# EAGLE design Nano RC Receiver (EAGLE 9.6.1)
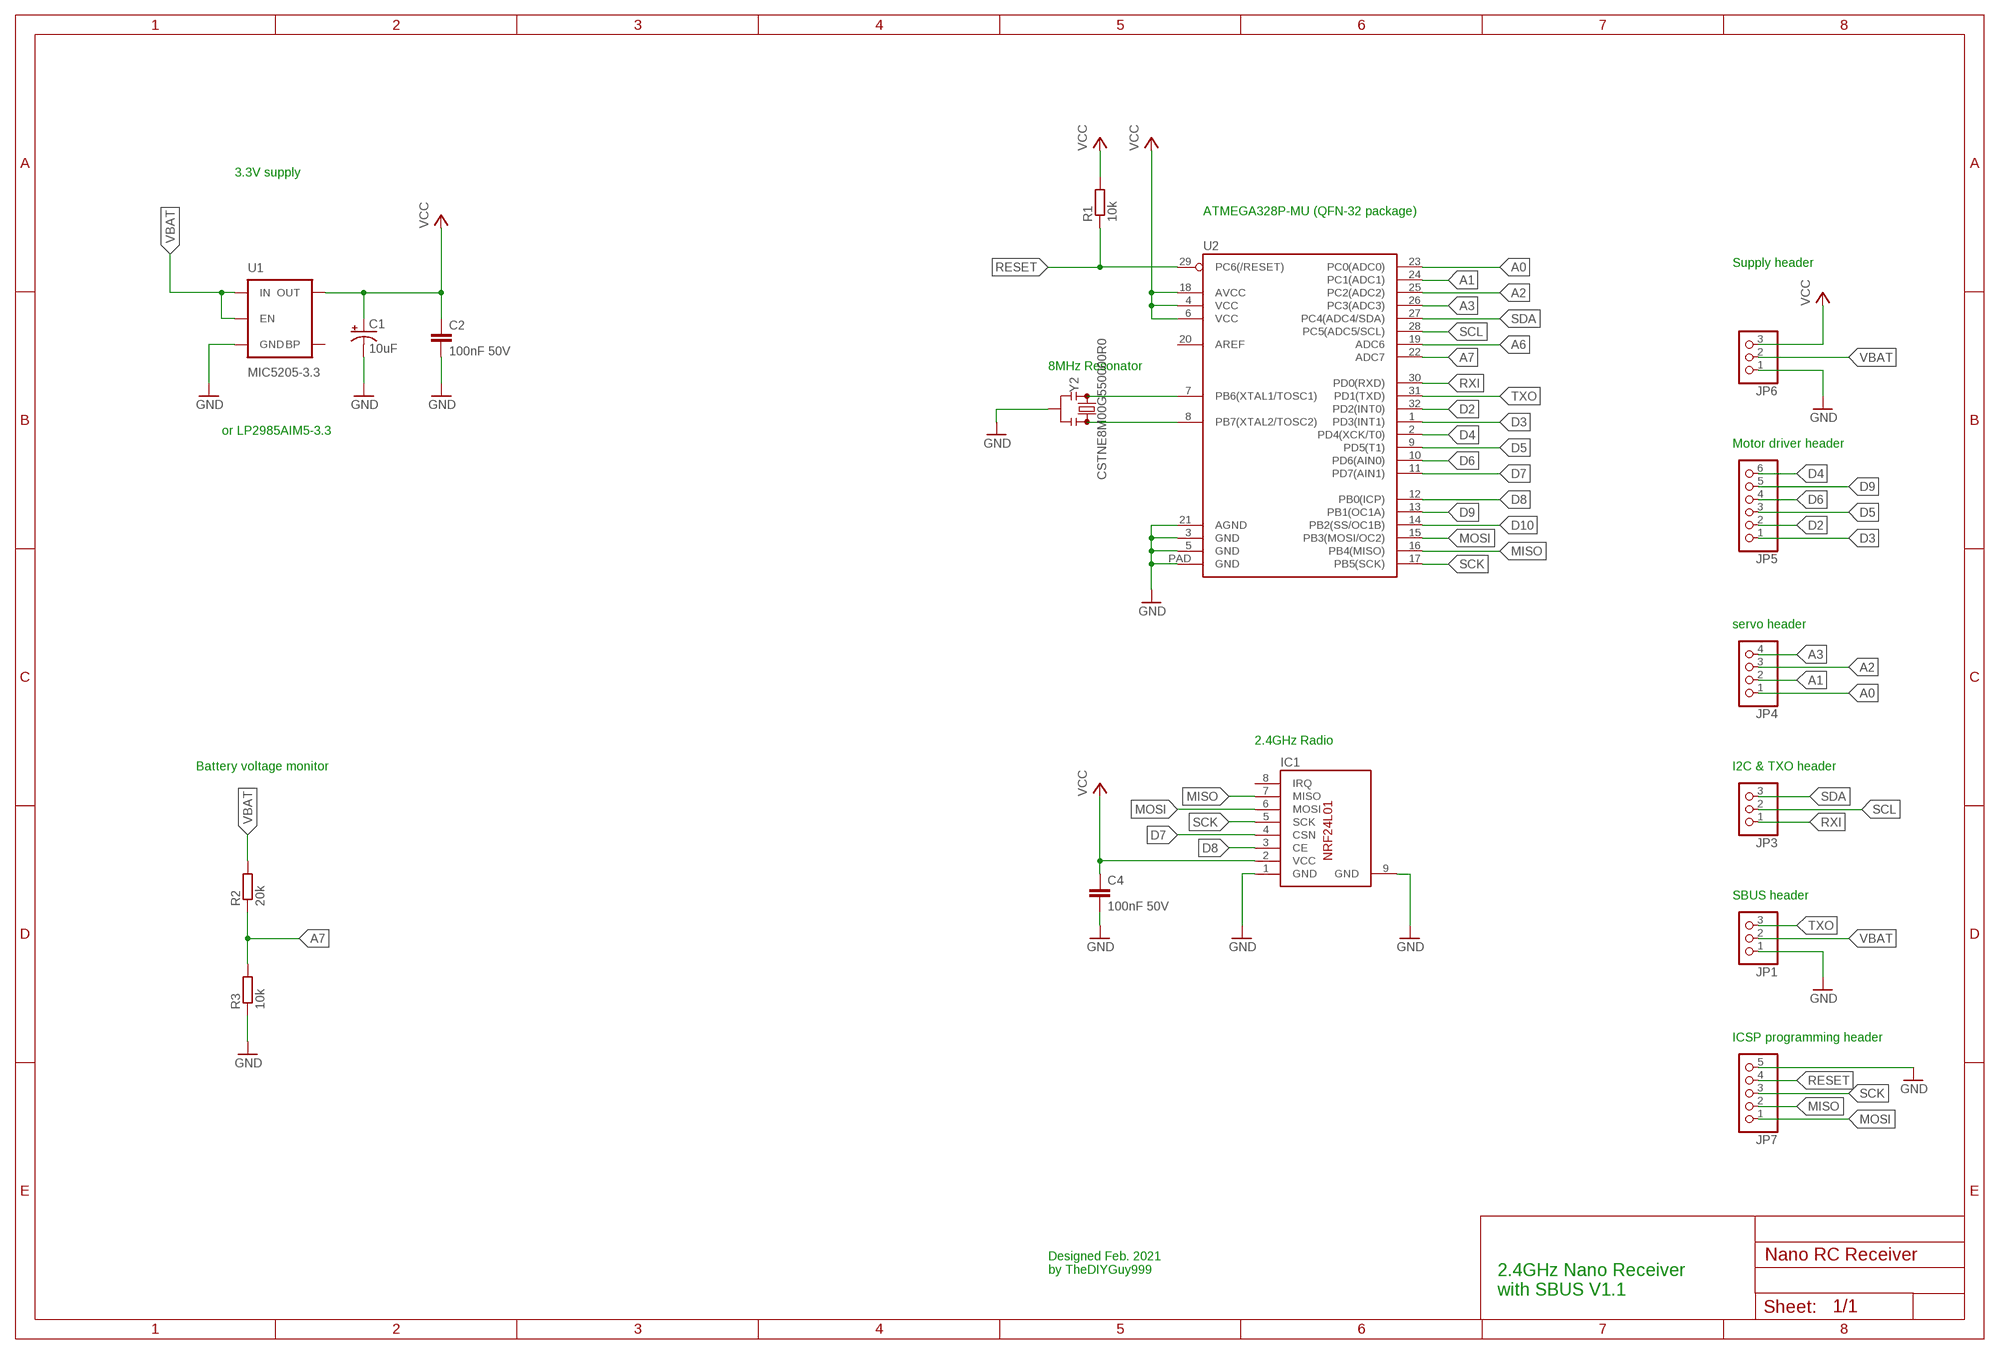
[diagram p0: schematic, sheet 1]

## Parts
C1  10uF  10UF-16V-10%(TANT)  [EIA3216]
C2  100nF 50V  C-EUC0603  [C0603]
C4  100nF 50V  C-EUC0603  [C0603]
IC1  NRF24L01SMD_PAD  [NRF24L01_SMD_PAD]
JP1  PINHD-1X3SMT  [1X03_SMT]
JP3  PINHD-1X31.27  [1X03_1.27]
JP4  PINHD-1X41.27  [1X04_1.27]
JP5  PINHD-1X61.27  [1X06_1.27]
JP6  PINHD-1X31.27  [1X03_1.27]
JP7  PINHD-1X51.27  [1X05_1.27]
R1  10k  R-EU_R0603  [R0603]
R2  20k  R-EU_R0603  [R0603]
R3  10k  R-EU_R0603  [R0603]
U1  MIC5205-3.3  MIC52053.3V  [SOT23-5]
U2  ATMEGA328P_MLFMLF32  [MLF32-PAD]
Y2  CSTNE8M00G550000R0  RESONATORSMD-3.2X1.3  [RESONATOR-SMD-3.2X1.3]

## Nets
A0: JP4.1 U2.23(PC0(ADC0))
A1: JP4.2 U2.24(PC1(ADC1))
A2: JP4.3 U2.25(PC2(ADC2))
A3: JP4.4 U2.26(PC3(ADC3))
A6: U2.19(ADC6)
A7: R2.1 R3.2 U2.22(ADC7)
D2: JP5.2 U2.32(PD2(INT0))
D3: JP5.1 U2.1(PD3(INT1))
D4: JP5.6 U2.2(PD4(XCK/T0))
D5: JP5.3 U2.9(PD5(T1))
D6: JP5.4 U2.10(PD6(AIN0))
D7: IC1.4(CSN) U2.11(PD7(AIN1))
D8: IC1.3(CE) U2.12(PB0(ICP))
D9: JP5.5 U2.13(PB1(OC1A))
D10: U2.14(PB2(SS/OC1B))
GND: C1.C(-) C2.2 C4.2 IC1.1(GND) IC1.9(GND) JP1.1 JP6.1 JP7.5 R3.1 U1.2(GND) U2.3(GND) U2.5(GND) U2.21(AGND) U2.PAD(GND) Y2.2
MISO: IC1.7(MISO) JP7.2 U2.16(PB4(MISO))
MOSI: IC1.6(MOSI) JP7.1 U2.15(PB3(MOSI/OC2))
RESET: JP7.4 R1.1 U2.29(PC6(/RESET))
RXI: JP3.1 U2.30(PD0(RXD))
SCK: IC1.5(SCK) JP7.3 U2.17(PB5(SCK))
SCL: JP3.2 U2.28(PC5(ADC5/SCL))
SDA: JP3.3 U2.27(PC4(ADC4/SDA))
TOSC1: U2.7(PB6(XTAL1/TOSC1)) Y2.1
TOSC2: U2.8(PB7(XTAL2/TOSC2)) Y2.3
TXO: JP1.3 U2.31(PD1(TXD))
VBAT: JP1.2 JP6.2 R2.2 U1.1(IN) U1.3(EN)
VCC: C1.A(+) C2.1 C4.1 IC1.2(VCC) JP6.3 R1.2 U1.5(OUT) U2.4(VCC) U2.6(VCC) U2.18(AVCC)
Unconnected: IC1.8(IRQ) U1.4(BP) U2.20(AREF)

## Notes on the sheet
- 3.3V supply
- ATMEGA328P-MU (QFN-32 package)
- Supply header
- 8MHz Resonator
- or LP2985AIM5-3.3
- Motor driver header
- servo header
- 2.4GHz Radio
- Battery voltage monitor | I2C & TXO header
- SBUS header
- ICSP programming header
- Designed Feb. 2021
  by TheDIYGuy999
- 2.4GHz Nano Receiver
  with SBUS V1.1

## Library data of the parts
C1 = SparkFun-Capacitors:10UF-16V-10%(TANT): CAP-00811 1206/EIA-3216 Tantalum capacitor; PROD_ID: CAP-00811
C2 C4 = rcl:C-EU: CAPACITOR, European symbol; SPICEPREFIX: C
IC1 = 00_custom:NRF24L01: 2.4GHz Radio Module
JP1 JP3 JP6 = 00_custom_pinhead:PINHD-1X3: PIN HEADER
JP4 = 00_custom_pinhead:PINHD-1X4: PIN HEADER
JP5 = 00_custom_pinhead:PINHD-1X6: PIN HEADER
JP7 = 00_custom_pinhead:PINHD-1X5: PIN HEADER
R1-R3 = rcl:R-EU_: RESISTOR, European symbol; SPICEPREFIX: R
U1 = SparkFun-PowerIC:MIC5205: MIC5205 150mA vreg 3.3V - VREG-00822 5V - VREG-00823; PROD_ID: VREG-00822
U2 = SparkFun-IC-Microcontroller:ATMEGA328P_MLF: Datasheet SparkFun Products () () 32-Pin Atmega328 part Commonly used on Arduino compatible boards Available in QFP and QFN packages TQFP is IC-09069 QFN is non-stock
Y2 = SparkFun-Clocks:RESONATOR: Resonators (Generic) Ceramic resonators are clock-generating components, often used to control timing in microcontrollers. They usually have 3 pins: two pins for oscillation, and one pin for ground. Compared to crystals, resonators have worse tolerance, but are usually much cheaper. Plus, they have built-in load capacitors! These devices are used on boards like the Arduino Pro 8MHz <https://www.sparkfun.com/products/11114> and Arduino Pro 16MHz <https://www.sparkfun.com/products/11113>.

## Board
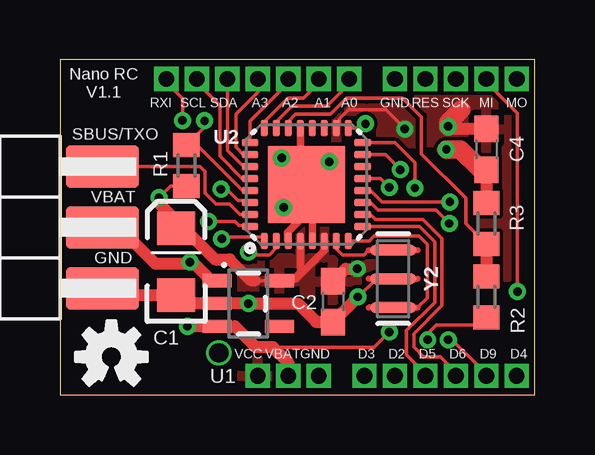
[diagram p1: board, top side]
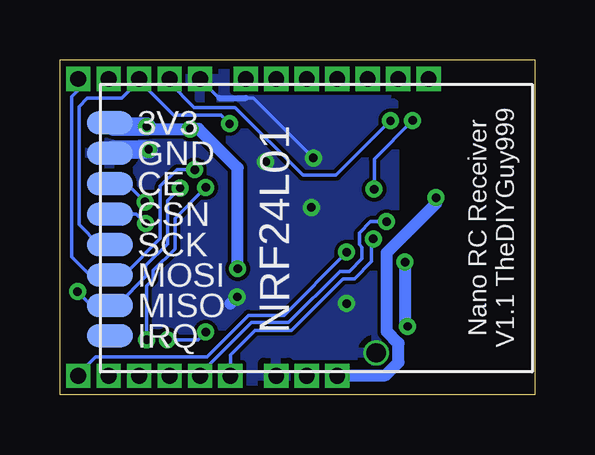
[diagram p2: board, bottom side, seen from below]

Size 19.81 x 13.97 mm. Coordinates in mm from the lower left corner, seen from the top.
Outline: 0,0 19.81,0 19.81,13.97 0,13.97 0,0
Copper layers (1*16): Top 0.0356mm / dielectric 1.5011mm / Bottom 0.0356mm
Design rules "OSHPark_LaenPCBOrder *": minimum track width 6mil, minimum drill 13mil, track to track 6mil, track to pad 6mil, pad to pad 6mil, via to via 6mil, smd to smd 6mil, copper to edge 15mil, drill to drill 6mil, minimum pad ring 5mil, minimum via ring 7mil, stop-mask expansion 1mil, vias tented up to drill 24mil, thermal gap 10mil

### Footprints (pad centres in the part's own frame; a part is rotated, then mirrored left to right if it is on the bottom)
EIA3216 = smd 1.4 x 1.6: A 1.4,0; C -1.4,0
C0603 = smd 1.1 x 1: 1 -0.85,0; 2 0.85,0
NRF24L01_SMD_PAD = smd 0.965 x 1.93: 1 1.27,-0.508; 2 0,-0.508; 3 2.54,-0.508; 4 3.81,-0.508; 5 5.08,-0.508; 6 6.35,-0.508; 7 7.62,-0.508; 8 8.89,-0.508 | drill 0.8 pad 1.016: 9 9.6,10.6
1X03_SMT = smd 1.778 x 3.048: 1 0,-1.143; 2 2.54,-1.143; 3 5.08,-1.143
1X03_1.27 = drill 0.65 pad 1.016 square: 1 0,0; 2 1.27,0; 3 2.54,0
1X04_1.27 = drill 0.65 pad 1.016 square: 1 0,0; 2 1.27,0; 3 2.54,0; 4 3.81,0
1X06_1.27 = drill 0.65 pad 1.016 square: 1 0,0; 2 1.27,0; 3 2.54,0; 4 3.81,0; 5 5.08,0; 6 6.35,0
1X05_1.27 = drill 0.65 pad 1.016 square: 1 0,0; 2 1.27,0; 3 2.54,0; 4 3.81,0; 5 5.08,0
R0603 = smd 1 x 1.1: 1 -0.85,0; 2 0.85,0
SOT23-5 = smd 0.55 x 1.2: 1 -0.95,-1.3; 2 0,-1.3; 3 0.95,-1.3; 4 0.95,1.3; 5 -0.95,1.3
MLF32-PAD = smd 0.7 x 0.3: 1 -2.35,1.75; 2 -2.35,1.25; 3 -2.35,0.75; 4 -2.35,0.25; 5 -2.35,-0.25; 6 -2.35,-0.75; 7 -2.35,-1.25; 8 -2.35,-1.75; 17 2.35,-1.75; 18 2.35,-1.25; 19 2.35,-0.75; 20 2.35,-0.25; 21 2.35,0.25; 22 2.35,0.75; 23 2.35,1.25; 24 2.35,1.75 | smd 0.3 x 0.7: 9 -1.75,-2.35; 10 -1.25,-2.35; 11 -0.75,-2.35; 12 -0.25,-2.35; 13 0.25,-2.35; 14 0.75,-2.35; 15 1.25,-2.35; 16 1.75,-2.35; 25 1.75,2.35; 26 1.25,2.35; 27 0.75,2.35; 28 0.25,2.35; 29 -0.25,2.35; 30 -0.75,2.35; 31 -1.25,2.35; 32 -1.75,2.35 | smd 3.2 x 3.2: PAD 0,0
RESONATOR-SMD-3.2X1.3 = smd 0.45 x 1.905: 1 -1.2,0; 2 0,0; 3 1.2,0

### Placement (x,y rotation side)
C1  4.84,5.56 90 top
C2  11.39,3.89 270 top
C4  17.78,10.24 270 top
IC1  17.22,11.35 270 bottom
JP1  0.64,4.45 90 top
JP3  4.45,13.18 0 top
JP4  12.06,13.18 180 top
JP5  12.7,0.79 0 top
JP6  10.79,0.79 180 top
JP7  19.05,13.18 180 top
LOGO2  OSHW-LOGOS  [OSHW-LOGO-S]  2.14,1.59 0 top
R1  5.28,9.56 270 top
R2  17.78,4.09 270 top
R3  17.78,7.14 270 top
U1  7.86,3.81 270 top
U2  10.28,8.77 90 top
Y2  13.89,4.84 270 top

### Tracks (layer width: path | path; a pad name or v marks a point on that pad's centre or on a via)
A0
  Top 0.152: U2.23 9.07,11.16 9.07,11.44 9.68,12.05 11.13,12.05 12.06,12.99 JP4.1
A1
  Top 0.152: U2.24 8.57,11.16 8.57,11.44 9.51,12.38 10.16,12.38 10.79,13.02 JP4.2
A2
  Top 0.152: JP4.3 9.53,13.02 7.93,11.42 U2.25
A3
  Top 0.152: U2.26 7.89,9.98 7.69,9.98 7.34,10.33 7.34,11.71 8.26,12.62 JP4.4
A7
  Top 0.152: R3.2 16.92,7.15 16.92,8.21 15.08,10.05 15.08,11.59 14.29,12.38 12.8,12.38 12.79,12.37 11.94,12.37 11.27,11.7 9.83,11.7 9.51,11.38 9.53,11.36 U2.22
  Top 0.508: R3.2 R2.1
D2  (via drill 0.35)
  Top 0.152: U2.32 7.89,7.06 7.46,7.06 7.3,7.22 v6.19,7.22
  Bottom 0.152: v6.19,7.22 6.86,7.22 7.33,6.75 7.33,6.27 7.21,6.15 7.21,5.68 7.74,5.15 8.14,5.15 10.27,3.02 11.83,3.02 13.97,0.87 JP5.2
D3  (via drill 0.35)
  Top 0.152: U2.1 8.53,6.59 6.83,6.59 v6.75,6.51
  Bottom 0.152: v6.75,6.51 6.83,6.43 6.83,5.56 7.54,4.84 8.01,4.84 10.15,2.7 11.67,2.7 12.7,1.67 JP5.1
D4  (via drill 0.35)
  Top 0.152: v7.86,5.95 7.97,5.84 8.73,5.84 8.99,6.1 8.99,6.38 U2.2
  Bottom 0.152: JP5.6 18.99,0.85 18.99,0.92 18.33,1.59 13.69,1.59 11.95,3.32 10.47,3.32 7.86,5.94 v7.86,5.95
D5
  Top 0.152: U2.9 15,7.02 15.63,6.39 15.63,3.86 14.45,2.68 14.45,1.67 15.24,0.87 JP5.3
D6
  Top 0.152: U2.10 12.95,7.52 13.15,7.32 15.12,7.32 15.93,6.51 15.93,3.74 14.75,2.55 14.75,2 15.16,1.59 15.87,1.59 16.51,0.94 JP5.4
D7  (via drill 0.35)
  Top 0.152: U2.11 12.95,8.02 13.26,7.7 15.68,7.7 v16.24,7.15
  Bottom 0.152: IC1.4 16.63,7.54 v16.24,7.15
D8  (via drill 0.35)
  Top 0.152: U2.12 12.95,8.52 13.42,8.04 15.55,8.04 15.55,8.05 v16.26,8.05
  Bottom 0.152: v16.26,8.05 17.03,8.81 IC1.3
D9  (via drill 0.35)
  Top 0.152: JP5.5 17.48,1.09 17.48,1.16 16.34,2.3 v16.19,2.3 | v13.73,8.65 13.36,9.02 U2.13
  Bottom 0.152: v16.19,2.3 16.19,4.54 15.93,4.8 15.93,5.18 15.02,6.09 15.02,7.37 v13.73,8.65
GND  (via drill 0.35)
  Top 0.152: Y2.2 13.83,4.78 13.13,4.78 v12.43,4.08 | v9.33,7.82 10.03,8.52 U2.21 10.03,10.27 9.64,9.88 v9.25,9.88
  Top 0.305: U2.21 10.03,9.02 U2.PAD | U2.5 10.53,7.28 10.84,7.58 10.84,8.21 U2.PAD | U2.PAD 10.28,7.56 9.49,6.77 9.49,6.46 U2.3
  Top 0.508: C4.2 R3.1 | v12.42,4.09 v12.43,4.08 C2.2 10.69,3.04 9.92,3.81 v7.86,3.81 U1.2 5.19,3.81 C1.C 2.19,4.16 JP1.1
  Top 0.762: C4.2 17.54,9.39 16.69,10.24 v16.11,10.24
  Bottom 0.152: JP7.5 13.18,12.38 | 12.06,12.38 11.75,12.38 v9.25,9.88
  Bottom 0.254: 13.18,12.38 12.06,12.38
  Bottom 0.508: v16.11,10.24 16.19,10.32 | v12.42,4.09 12.7,3.81
  Bottom 0.762: IC1.1 17.57,10.24 v16.11,10.24
  other vias: 11.23,9.72
  pour Bottom: 6.19,16.51 21.59,16.51 21.59,-2.54 5.87,-2.54 5.87,12.14 6.19,12.14
MISO  (via drill 0.35)
  Top 0.152: U2.16 13.97,10.52 14.8,9.68 v14.8,8.63 | v19.08,4.31 19.08,11.75 17.78,13.05 JP7.2
  Bottom 0.152: v19.08,4.31 v19.08,4.3 18.59,3.81 17.82,3.81 IC1.7 17.65,3.73 17.58,3.81 17.35,3.81 16.23,4.93 16.23,5.39 15.32,6.3 15.32,8.11 v14.8,8.63
MOSI  (via drill 0.35)
  Top 0.152: v14.19,9.39 13.56,10.02 U2.15
  Bottom 0.152: v14.19,9.39 14.94,9.39 15.63,8.7 15.63,6.52 17.14,5 IC1.6 18.57,5 19.32,5.75 19.32,12.44 19.06,12.71 JP7.1
RESET  (via drill 0.35)
  Top 0.152: U2.29 7.61,8.52 5.72,10.41 R1.1 6.03,11.17 v6.03,11.43
  Bottom 0.152: v6.03,11.43 8.29,9.17 9.68,9.17 12.5,11.99 14.21,11.99 15.24,13.02 JP7.4
RXI  (via drill 0.35)
  Top 0.152: U2.30 7.85,8.1 7.43,8.1 6.95,8.58 v6.71,8.58 | JP3.1 4.45,13.03 5.11,12.37 v5.11,11.44
  Bottom 0.152: v5.11,11.44 6.71,9.84 v6.71,8.58
SCK  (via drill 0.35)
  Top 0.152: v12.74,11.31 12.55,11.12 U2.17
  Bottom 0.152: v12.74,11.31 13.1,11.67 15.08,11.67 16.51,13.1 JP7.3 16.49,13.15 16.49,13.13 17.24,12.38 18.67,12.38 19.02,12.03 19.02,7.1 18.19,6.27 IC1.5
SCL
  Top 0.152: U2.28 7.72,9.02 7.71,9.02 7.59,9.02 6.67,9.95 6.67,12.06 5.71,13.02 JP3.2
SDA
  Top 0.152: U2.27 7.89,9.56 7.61,9.56 6.99,10.19 6.99,12.94 JP3.3
TOSC1
  Top 0.152: U2.7 11.53,6.09 11.78,5.84 12.67,5.84 12.87,6.04 Y2.1
TOSC2
  Top 0.152: U2.8 12.9,6.42 13.1,6.62 14.96,6.62 15.32,6.27 15.32,4.05 14.91,3.64 Y2.3
TXO
  Top 0.152: U2.31 7.51,7.52 7.07,7.96 6.5,7.96 6.06,8.41 6.06,9.31 5.84,9.52 1.91,9.52 JP1.3
VBAT  (via drill 0.35)
  Top 0.152: U1.3 7.46,2.86 8.33,1.98 8.57,1.98 | 8.89,1.98 13.1,1.98 v13.73,2.62 | R2.2 17.46,2.92 15.7,2.92 15.32,2.54 v15.32,2.3 v15.33,2.3
  Top 0.508: JP6.2 9.53,1.35 8.89,1.98 8.57,1.98 8.18,1.98 7.3,2.86 U1.3 v5.32,2.86 | JP1.2 2.46,6.99 3.97,5.48 5.49,5.48 | U1.1 6.31,4.76 5.6,5.48 5.49,5.48 | v5.42,5.54 5.49,5.48
  Bottom 0.152: v15.33,2.3 14.05,2.3 v13.73,2.62
  Bottom 0.508: v5.32,2.86 5.36,2.9 5.4,2.9 5.42,2.92 v5.42,5.54
VCC  (via drill 0.35)
  Top 0.152: U1.5 8.15,4.76 | R1.2 4.62,8.71 v4.13,8.23 | U2.18 11.65,11.24 11.65,11.52 12.02,11.89 13.59,11.89 v14.38,11.1 v14.38,11.09
  Top 0.305: U2.6 11.03,6.03 9.84,4.84 9.76,4.84 | U1.5 9.68,4.76 9.76,4.84 | U2.4 10.03,5.11 9.76,4.84
  Top 0.457: 7.08,5.65 7.97,4.76 8.15,4.76
  Top 0.508: v16.19,11.19 16.3,11.09 C4.1 | C2.1 11.91,5.26 v12.4,5.26 | 4.84,7.27 6.46,5.65 7.08,5.65 | v4.13,8.23 4.13,7.99 4.84,7.27 | C1.A 4.84,7.27
  Top 0.762: v16.19,11.19 16.19,11.35 16.75,11.91
  Bottom 0.508: JP6.3 8.23,0.82 6.24,0.82 5.69,1.36 5.69,2.16 6.18,2.65 6.18,5.93 4.13,7.99 v4.13,8.23 | v16.19,11.19 16.09,11.09 v14.38,11.09 14.02,11.09 12.4,9.46 v12.4,5.26
  Bottom 0.762: IC1.2 17.57,11.19 v16.19,11.19
  pour Top: 7.62,15.24 20.32,15.24 20.32,-1.27 7.62,-1.27

### Text on the board
bPlace: Nano RC Receiver / V1.1 TheDIYGuy999
tNames: Nano RC / V1.1 | RXI | SCL | SDA | A3 | A2 | A1 | A0 | GND | RES | SCK | MI | MO | SBUS/TXO | VBAT | GND | VCC | VBAT | GND | D3 | D2 | D5 | D6 | D9 | D4